# EAGLE design SpO2 (EAGLE 9.6.2)
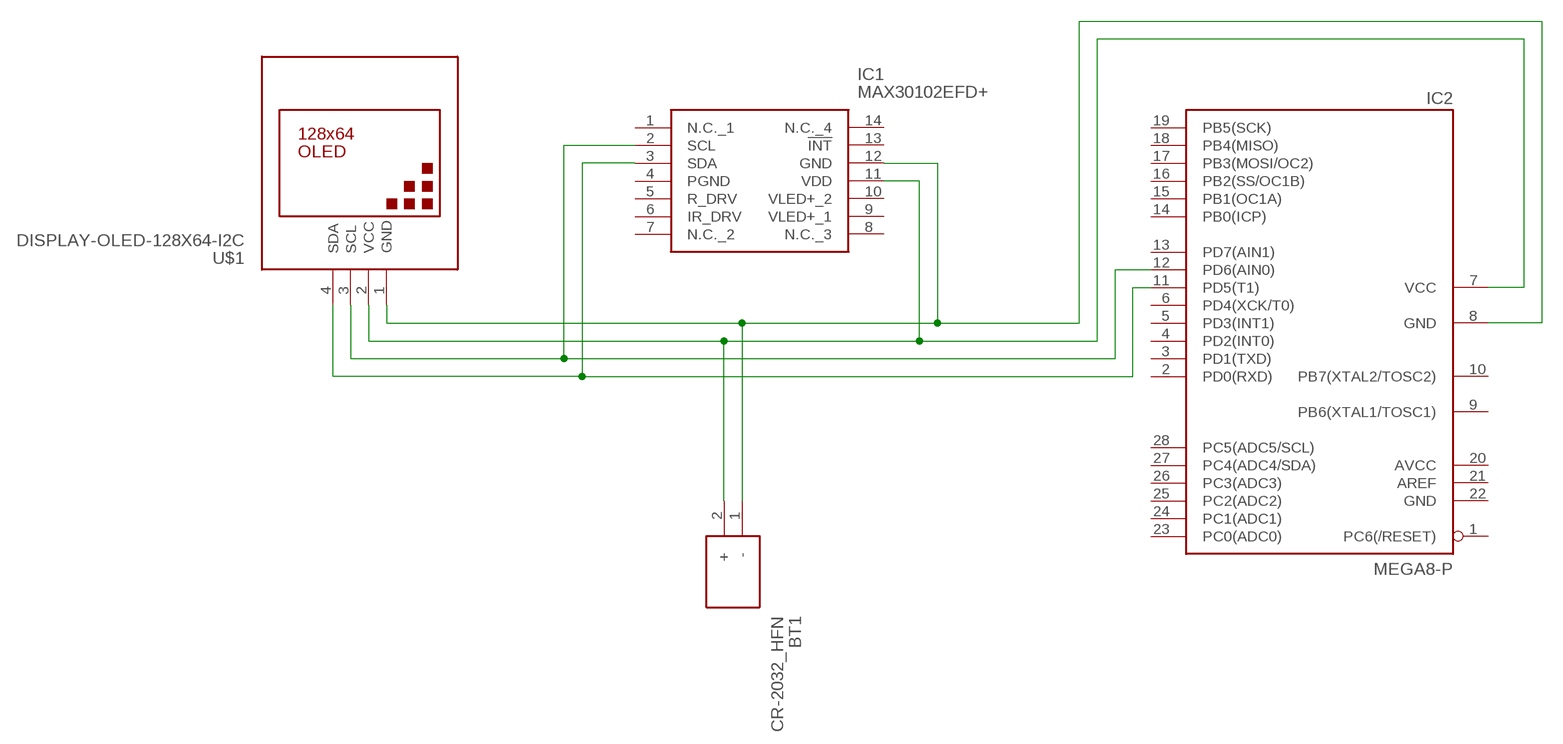
[diagram p0: schematic, sheet 1]

## Parts
BT1  CR-2032_HFN  [CR-2032HFN]
IC1  MAX30102EFD+  [14-LEAD-OESIP]
IC2  MEGA8-P  [DIL28-3]
U$1  DISPLAY-OLED-128X64-I2C  [DISPLAY-OLED-128X64-I2C]

## Nets
N$1: IC1.2(SCL) IC2.12(PD6(AIN0)) U$1.3(SCL)
N$2: IC1.3(SDA) IC2.11(PD5(T1)) U$1.4(SDA)
N$3: BT1.2(+) IC1.11(VDD) IC2.7(VCC) U$1.2(VCC)
N$4: BT1.1(-) IC1.12(GND) IC2.8(GND) U$1.1(GND)
Unconnected: IC1.1(N.C._1) IC1.4(PGND) IC1.5(R_DRV) IC1.6(IR_DRV) IC1.7(N.C._2) IC1.8(N.C._3) IC1.9(VLED+_1) IC1.10(VLED+_2) IC1.13(!INT) IC1.14(N.C._4) IC2.1(PC6(/RESET)) IC2.2(PD0(RXD)) IC2.3(PD1(TXD)) IC2.4(PD2(INT0)) IC2.5(PD3(INT1)) IC2.6(PD4(XCK/T0)) IC2.9(PB6(XTAL1/TOSC1)) IC2.10(PB7(XTAL2/TOSC2)) IC2.13(PD7(AIN1)) IC2.14(PB0(ICP)) IC2.15(PB1(OC1A)) IC2.16(PB2(SS/OC1B)) IC2.17(PB3(MOSI/OC2)) IC2.18(PB4(MISO)) IC2.19(PB5(SCK)) IC2.21(AREF) IC2.23(PC0(ADC0)) IC2.24(PC1(ADC1)) IC2.25(PC2(ADC2)) IC2.26(PC3(ADC3)) IC2.27(PC4(ADC4/SDA)) IC2.28(PC5(ADC5/SCL))

## Power pins joined to a net without a drawn wire
AVCC: IC2.20(AVCC)
GND: IC2.22(GND)

## Library data of the parts
BT1 = CR-2032_HFN:CR-2032_HFN: CR2032/1HF Non rechargeable Li coin cell Panasonic CR2032 3V Lithium Manganese Dioxide Coin Button Battery Source: Datasheet <http://industrial.panasonic.com/cdbs/www-data/pdf2/AAA4000/AAA4000DE87.pdf>; ARROW_PART_NUMBER: CR-2032/HFN; ARROW_PRICE-STOCK: https://www.arrow.com/en/products/cr-2032hfn/panasonic; DESCRIPTION: CR2032/1HF Non rechargeable Li coin cell Panasonic CR2032 3V Lithium Manganese Dioxide Coin Button Battery; HEIGHT: mm; MANUFACTURER_NAME: Panasonic; MANUFACTURER_PART_NUMBER: CR-2032/HFN; MOUSER_PART_NUMBER: 658-CR-2032/HFN; MOUSER_PRICE-STOCK: https://www.mouser.co.uk/ProductDetail/Panasonic-Battery/CR-2032-HFN?qs=w3%252Bcv6FlocpXdsVF%252BYgeww%3D%3D
IC1 = MAX30102EFD+:MAX30102EFD+: MAXIM INTEGRATED PRODUCTS - MAX30102EFD+ - PULSE OXIMETER/HEART RATE SENSOR, OESIP Source: Datasheet <https://datasheets.maximintegrated.com/en/ds/MAX30102.pdf>; DESCRIPTION: MAXIM INTEGRATED PRODUCTS - MAX30102EFD+ - PULSE OXIMETER/HEART RATE SENSOR, OESIP; HEIGHT: mm; MANUFACTURER_NAME: Maxim Integrated; MANUFACTURER_PART_NUMBER: MAX30102EFD+; MOUSER_PART_NUMBER: 700-MAX30102EFD+; MOUSER_PRICE-STOCK: https://www.mouser.co.uk/ProductDetail/Maxim-Integrated/MAX30102EFD%2b?qs=nVS1qgv%252BQrk9UYEvS27V%2Fg%3D%3D
IC2 = atmel:MEGA8-P: MICROCONTROLLER 8 Kbytes FLASH, 1 kbytes SRAM, 512 bytes EEPROM, USART, 4-channel 10 bit ADC, 2-channel 8 bit ADC Pin compatible with Atmega48, ATMega88, ATMega168 Source: avr.lbr; OC_FARNELL: unknown; OC_NEWARK: unknown
U$1 = diy-modules:DISPLAY-OLED-128X64-I2C: 128x64 Dot Matrix OLED Module based on SSD1306 chip Variant with I2C interface More details available here: http://www.instructables.com/id/Monochrome-096-i2c-OLED-display-with-arduino-SSD13/ SSD1306 datasheet: https://cdn-shop.adafruit.com/datasheets/SSD1306.pdf Click here to find device on ebay.com <http://www.ebay.com/sch/oled+display+128x64+iic> Note: There are two variants: I2C and SPI. Search for the proper version.

## Board
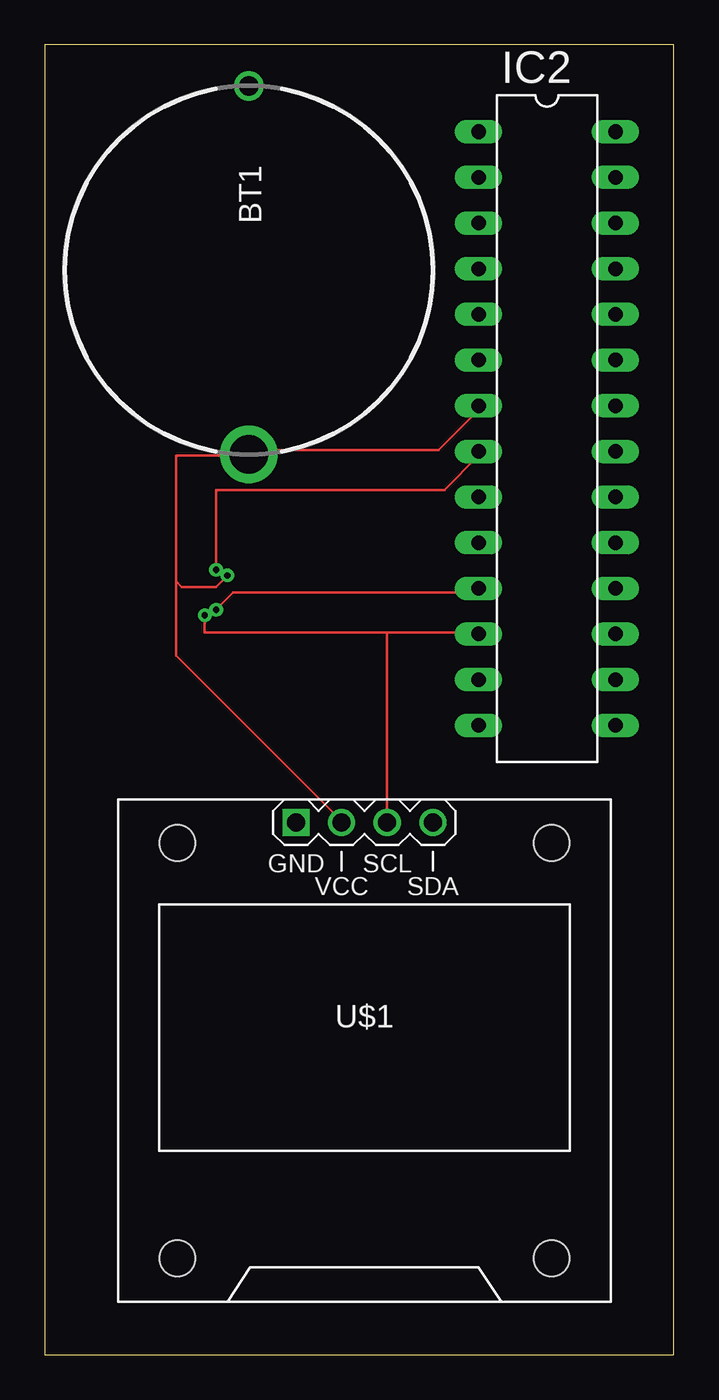
[diagram p1: board, top side]
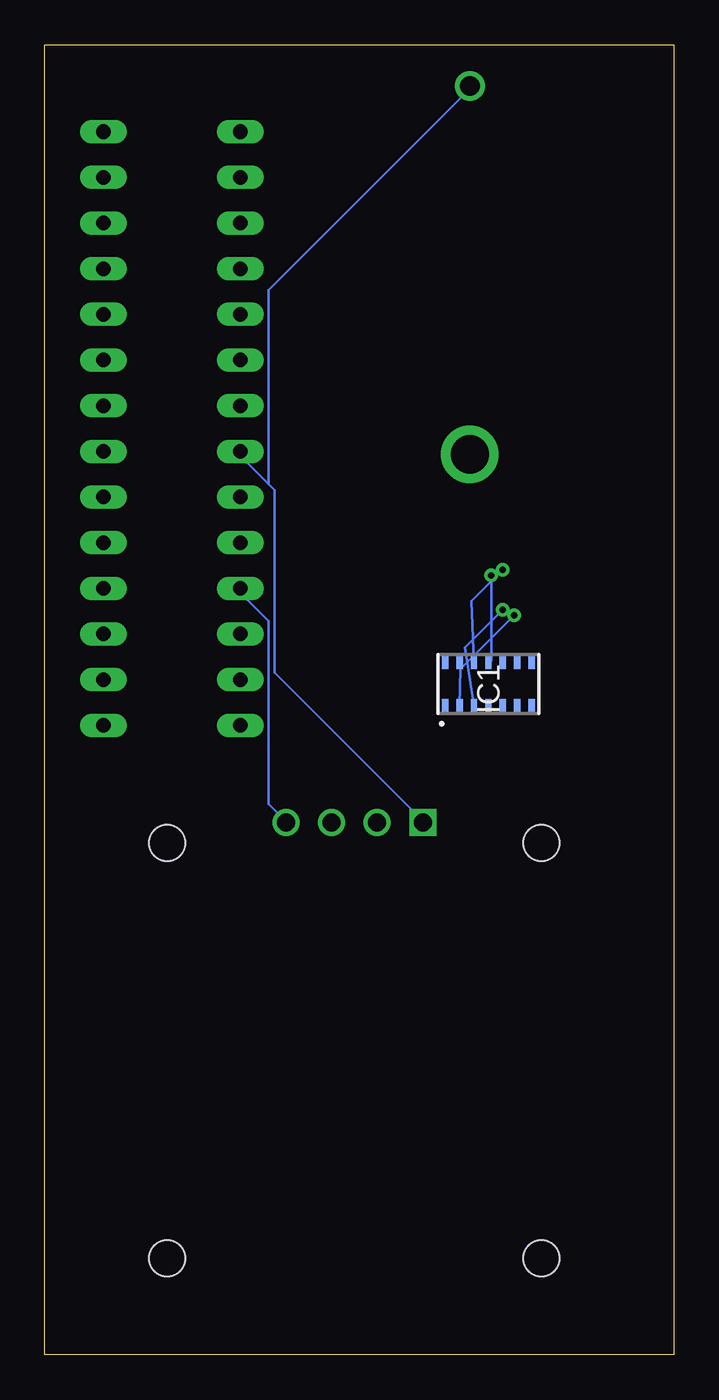
[diagram p2: board, bottom side, seen from below]

Size 35 x 72.86 mm. Coordinates in mm from the lower left corner, seen from the top.
Outline: 0,0 35,0 35,72.86 0,72.86 0,0
Copper layers (1*16): Top 0.035mm / dielectric 1.5mm / Bottom 0.035mm
Design rules "default": minimum track width 6mil, minimum drill 0.35mm, track to track 6mil, track to pad 6mil, pad to pad 6mil, via to via 6mil, smd to smd 6mil, copper to edge 40mil, drill to drill 6mil, minimum pad ring 10mil, minimum via ring 8mil, stop-mask expansion 4mil, vias tented up to drill 0mil, thermal gap 10mil

### Footprints (pad centres in the part's own frame; a part is rotated, then mirrored left to right if it is on the bottom)
CR-2032HFN = drill 1.09 pad 1.65: 1 -10.25,0 | drill 2.12 pad 3.2: 2 10.25,0
14-LEAD-OESIP = smd 0.75 x 0.35: 1 -1.2,2.4; 2 -1.2,1.6; 3 -1.2,0.8; 4 -1.2,0; 5 -1.2,-0.8; 6 -1.2,-1.6; 7 -1.2,-2.4; 8 1.2,-2.4; 9 1.2,-1.6; 10 1.2,-0.8; 11 1.2,0; 12 1.2,0.8; 13 1.2,1.6; 14 1.2,2.4
DIL28-3 = drill 0.813 long: 1 -16.51,-3.81; 2 -13.97,-3.81; 3 -11.43,-3.81; 4 -8.89,-3.81; 5 -6.35,-3.81; 6 -3.81,-3.81; 7 -1.27,-3.81; 8 1.27,-3.81; 9 3.81,-3.81; 10 6.35,-3.81; 11 8.89,-3.81; 12 11.43,-3.81; 13 13.97,-3.81; 14 16.51,-3.81; 15 16.51,3.81; 16 13.97,3.81; 17 11.43,3.81; 18 8.89,3.81; 19 6.35,3.81; 20 3.81,3.81; 21 1.27,3.81; 22 -1.27,3.81; 23 -3.81,3.81; 24 -6.35,3.81; 25 -8.89,3.81; 26 -11.43,3.81; 27 -13.97,3.81; 28 -16.51,3.81
DISPLAY-OLED-128X64-I2C = drill 1 square: 1 -3.81,12.7 | drill 1: 2 -1.27,12.7; 3 1.27,12.7; 4 3.81,12.7 | hole 2: -10.414,11.557; 10.414,11.557; 10.414,-11.557; -10.414,-11.557

### Placement (x,y rotation side)
BT1  11.35,60.33 270 top
IC1  10.32,37.31 90 bottom
IC2  27.94,51.52 270 top
U$1  17.78,16.91 0 top

### Tracks (layer width: path | path; a pad name or v marks a point on that pad's centre or on a via)
N$1  (via drill 0.35)
  Top 0.152: v8.89,41.12 8.89,40.17 19.05,40.17 | 19.05,40.17 24.13,40.17 IC2.12 | 19.05,40.17 U$1.3
  Bottom 0.152: v8.89,41.12 11.88,38.14 IC1.2
N$2  (via drill 0.35)
  Top 0.152: v9.53,41.44 10.48,42.39 24.13,42.39 IC2.11
  Bottom 0.152: v9.53,41.44 11.63,39.34 IC1.3 | U$1.4 21.59,29.69 22.54,30.64 22.54,40.8 24.13,42.39 IC2.11
N$3  (via drill 0.35)
  Top 0.152: v10.16,43.34 9.53,42.71 7.62,42.71 7.3,43.03 | 7.3,43.03 7.3,50.01 11.11,50.01 BT1.2 11.43,50.33 21.91,50.33 24.13,52.55 IC2.7 | 7.3,43.03 7.3,38.9 16.51,29.69 U$1.2
  Bottom 0.152: IC1.11 10.16,38.61 v10.16,43.34
N$4  (via drill 0.35)
  Top 0.152: v9.53,43.66 9.53,48.11 22.23,48.11 24.13,50.01 IC2.8
  Bottom 0.152: v9.53,43.66 11.28,41.91 IC1.12 | 22.54,48.42 24.13,50.01 IC2.8 | 22.54,48.42 22.23,48.11 22.23,37.95 13.97,29.69 U$1.1 | 22.54,48.42 22.54,59.22 11.43,70.33 BT1.1